# Altium schematic sheet Motor_Drivers.SchDoc: Motor Drivers
size A4; CompanyName: St. Cloud State University; Organization: Senior Design Project; Address1: Prosthetic Hand; Address2: Matthew Varas; Address3: Rachel Mertz; Address4: Donnell Jones; DocumentNumber: 5; Revision: 1.1; SheetNumber: 5; SheetTotal: 5
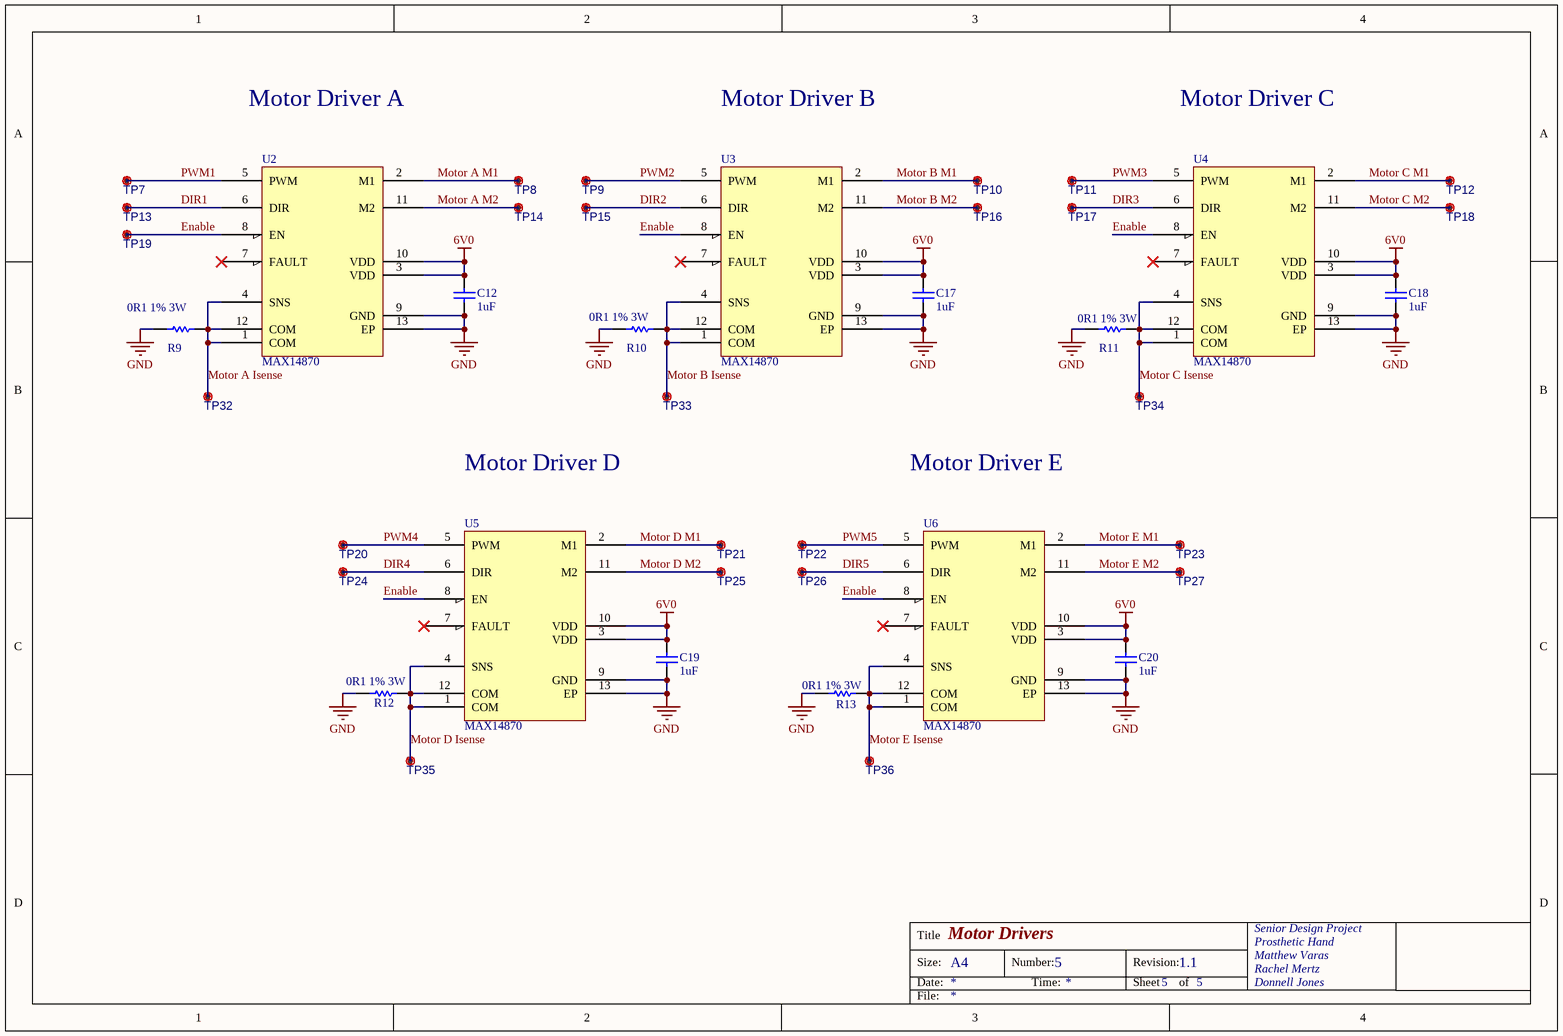
[diagram p0: Motor_Drivers.SchDoc]

## Parts
C12  1uF  [CAPC0402(1005)60_N]
C17  1uF  [CAPC0402(1005)60_N]
C18  1uF  [CAPC0402(1005)60_N]
C19  1uF  [CAPC0402(1005)60_N]
C20  1uF  [CAPC0402(1005)60_N]
R9  0R1 1% 3W  [RESC2512(6432)_N]
R10  0R1 1% 3W  [RESC2512(6432)_N]
R11  0R1 1% 3W  [RESC2512(6432)_N]
R12  0R1 1% 3W  [RESC2512(6432)_N]
R13  0R1 1% 3W  [RESC2512(6432)_N]
TP7  Test Point  [Testpoint_70]  (value not drawn)
TP8  Test Point  [Testpoint_70]  (value not drawn)
TP9  Test Point  [Testpoint_70]  (value not drawn)
TP10  Test Point  [Testpoint_70]  (value not drawn)
TP11  Test Point  [Testpoint_70]  (value not drawn)
TP12  Test Point  [Testpoint_70]  (value not drawn)
TP13  Test Point  [Testpoint_70]  (value not drawn)
TP14  Test Point  [Testpoint_70]  (value not drawn)
TP15  Test Point  [Testpoint_70]  (value not drawn)
TP16  Test Point  [Testpoint_70]  (value not drawn)
TP17  Test Point  [Testpoint_70]  (value not drawn)
TP18  Test Point  [Testpoint_70]  (value not drawn)
TP19  Test Point  [Testpoint_70]  (value not drawn)
TP20  Test Point  [Testpoint_70]  (value not drawn)
TP21  Test Point  [Testpoint_70]  (value not drawn)
TP22  Test Point  [Testpoint_70]  (value not drawn)
TP23  Test Point  [Testpoint_70]  (value not drawn)
TP24  Test Point  [Testpoint_70]  (value not drawn)
TP25  Test Point  [Testpoint_70]  (value not drawn)
TP26  Test Point  [Testpoint_70]  (value not drawn)
TP27  Test Point  [Testpoint_70]  (value not drawn)
TP32  Test Point  [Testpoint_70]  (value not drawn)
TP33  Test Point  [Testpoint_70]  (value not drawn)
TP34  Test Point  [Testpoint_70]  (value not drawn)
TP35  Test Point  [Testpoint_70]  (value not drawn)
TP36  Test Point  [Testpoint_70]  (value not drawn)
U2  MAX14870  [12L TDFN 3x3]
U3  MAX14870  [12L TDFN 3x3]
U4  MAX14870  [12L TDFN 3x3]
U5  MAX14870  [12L TDFN 3x3]
U6  MAX14870  [12L TDFN 3x3]

## Nets
6V0: C12.2 C17.2 C18.2 C19.2 C20.2 U2.3(VDD) U2.10(VDD) U3.3(VDD) U3.10(VDD) U4.3(VDD) U4.10(VDD) U5.3(VDD) U5.10(VDD) U6.3(VDD) U6.10(VDD)
GND: C12.1 C17.1 C18.1 C19.1 C20.1 R9.1 R10.1 R11.1 R12.1 R13.1 U2.9(GND) U2.13(EP) U3.9(GND) U3.13(EP) U4.9(GND) U4.13(EP) U5.9(GND) U5.13(EP) U6.9(GND) U6.13(EP)
DIR1: TP13.1(M80) U2.6(DIR)
DIR2: TP15.1(M80) U3.6(DIR)
DIR3: TP17.1(M80) U4.6(DIR)
DIR4: TP24.1(M80) U5.6(DIR)
DIR5: TP26.1(M80) U6.6(DIR)
Enable: TP19.1(M80) U2.8(EN) U3.8(EN) U4.8(EN) U5.8(EN) U6.8(EN)
Motor A Isense: R9.2 TP32.1(M80) U2.1(COM) U2.4(SNS) U2.12(COM)
Motor A M1: TP8.1(M80) U2.2(M1)
Motor A M2: TP14.1(M80) U2.11(M2)
Motor B Isense: R10.2 TP33.1(M80) U3.1(COM) U3.4(SNS) U3.12(COM)
Motor B M1: TP10.1(M80) U3.2(M1)
Motor B M2: TP16.1(M80) U3.11(M2)
Motor C Isense: R11.2 TP34.1(M80) U4.1(COM) U4.4(SNS) U4.12(COM)
Motor C M1: TP12.1(M80) U4.2(M1)
Motor C M2: TP18.1(M80) U4.11(M2)
Motor D Isense: R12.2 TP35.1(M80) U5.1(COM) U5.4(SNS) U5.12(COM)
Motor D M1: TP21.1(M80) U5.2(M1)
Motor D M2: TP25.1(M80) U5.11(M2)
Motor E Isense: R13.2 TP36.1(M80) U6.1(COM) U6.4(SNS) U6.12(COM)
Motor E M1: TP23.1(M80) U6.2(M1)
Motor E M2: TP27.1(M80) U6.11(M2)
PWM1: TP7.1(M80) U2.5(PWM)
PWM2: TP9.1(M80) U3.5(PWM)
PWM3: TP11.1(M80) U4.5(PWM)
PWM4: TP20.1(M80) U5.5(PWM)
PWM5: TP22.1(M80) U6.5(PWM)

Not connected (* = marked no-connect by the designer): U2 7(FAULT)*; U3 7(FAULT)*; U4 7(FAULT)*; U5 7(FAULT)*; U6 7(FAULT)*

## Notes on the sheet
- Motor Driver A
- Motor Driver B
- Motor Driver C
- Motor Driver D
- Motor Driver E
- Title
- Size:
- Date:
- A4
- Number:
- Time:
- Revision:
- Sheet
- of
- File:

## Library data of the parts
C12 C17-C20 = CMP-1034-02119-1: CAP CER 1UF 16V X5R 0402; Case-EIA: 0402; Tolerance: Â±10%; Case-Metric: 1005; MFG_PN01: GRT155R61C105KE01D; MFG_NAME01: Murata; DIGI_PN01: 490-12255-1-ND; Technology: SMT; Rated Voltage: 16 V; Max Thickness: 0.6 mm; Value: 1uF
R9-R13 = CMP-1018-00002-1: RES SMD 0.1 OHM 1% 3W 2512; Case-Metric: 6432; Value: 0.1 Ohm; Case-EIA: 2512; DIGI_PN01: CRA2512-FZ-R100ELFCT-ND; MFG_PN01: CRA2512-FZ-R100ELF; MFG_NAME01: Bourns; Technology: SMT; Power: 3W; Tolerance: 1%
TP7-TP27 TP32-TP36 = Test Point: Test Pad; MFG_PN01: DNP; MFG_NAME01: DNP; DNP: DNP
U2-U6 = MAX14870: IC MOTOR DVR DC FULL BR 12TDFN; MFG_NAME01: Maxim Integrated; MFG_PN01: MAX14870ETC+T; DIGI_PN01: MAX14870ETC+CT-ND; Case-EIA: 12-WFDFN